# EAGLE design ATM9036_3P4W (EAGLE 9.6.2)
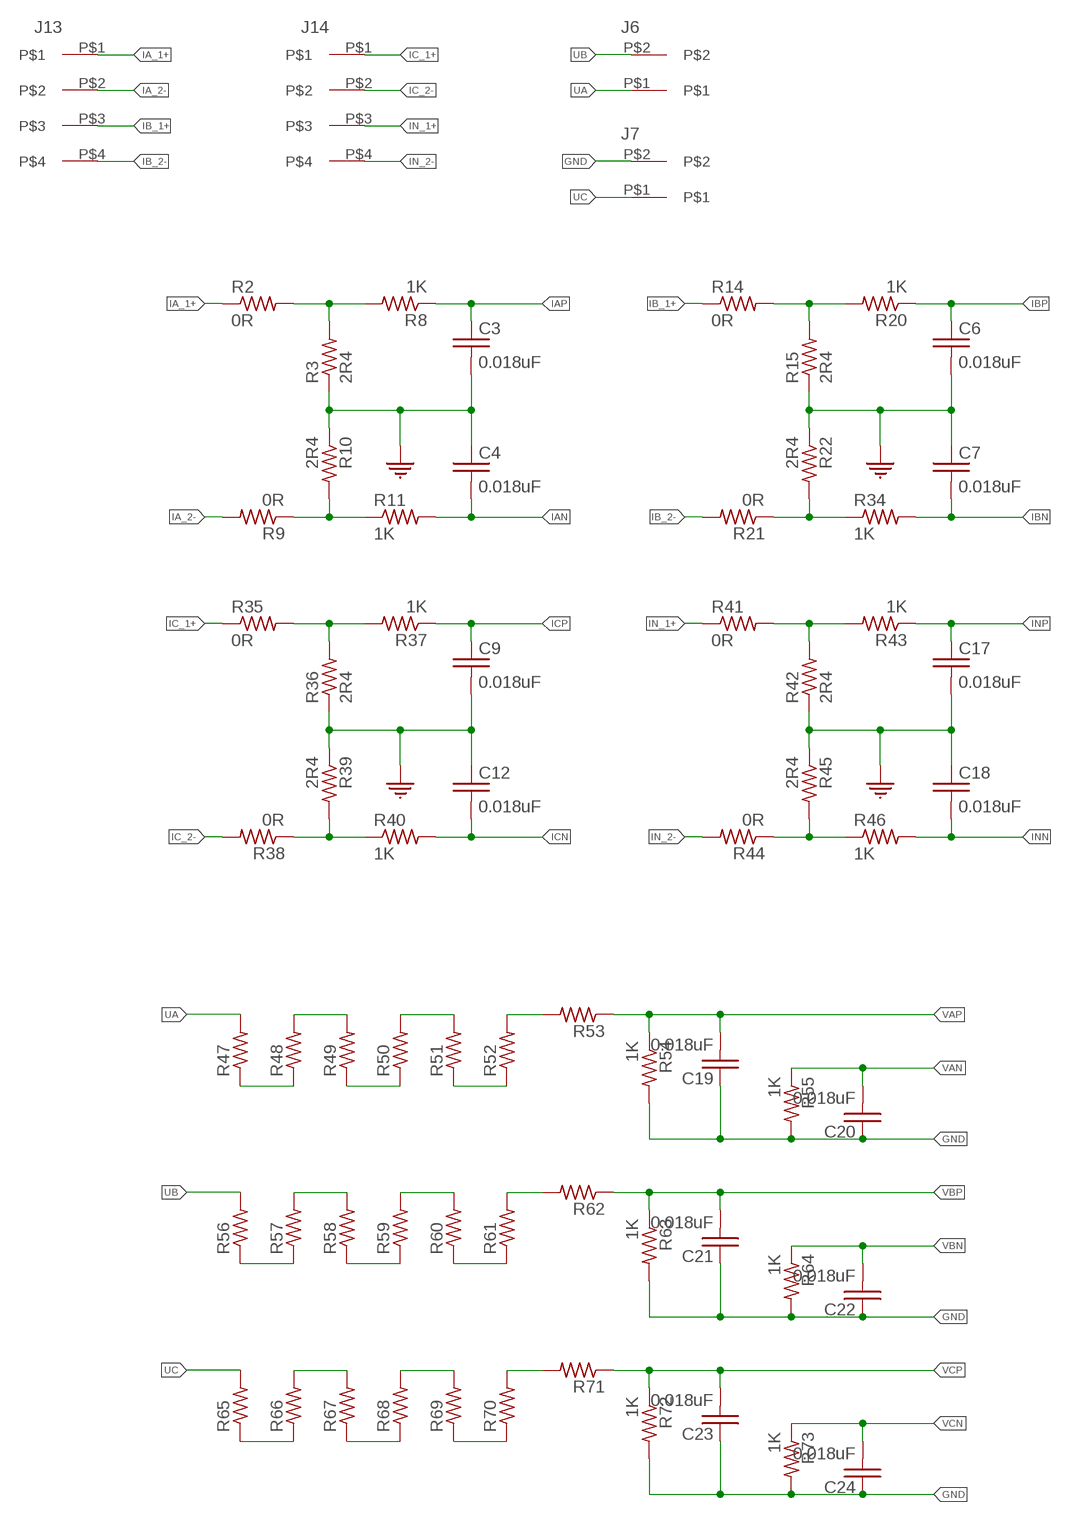
[diagram p0: schematic, sheet 1, part 1 of 2]
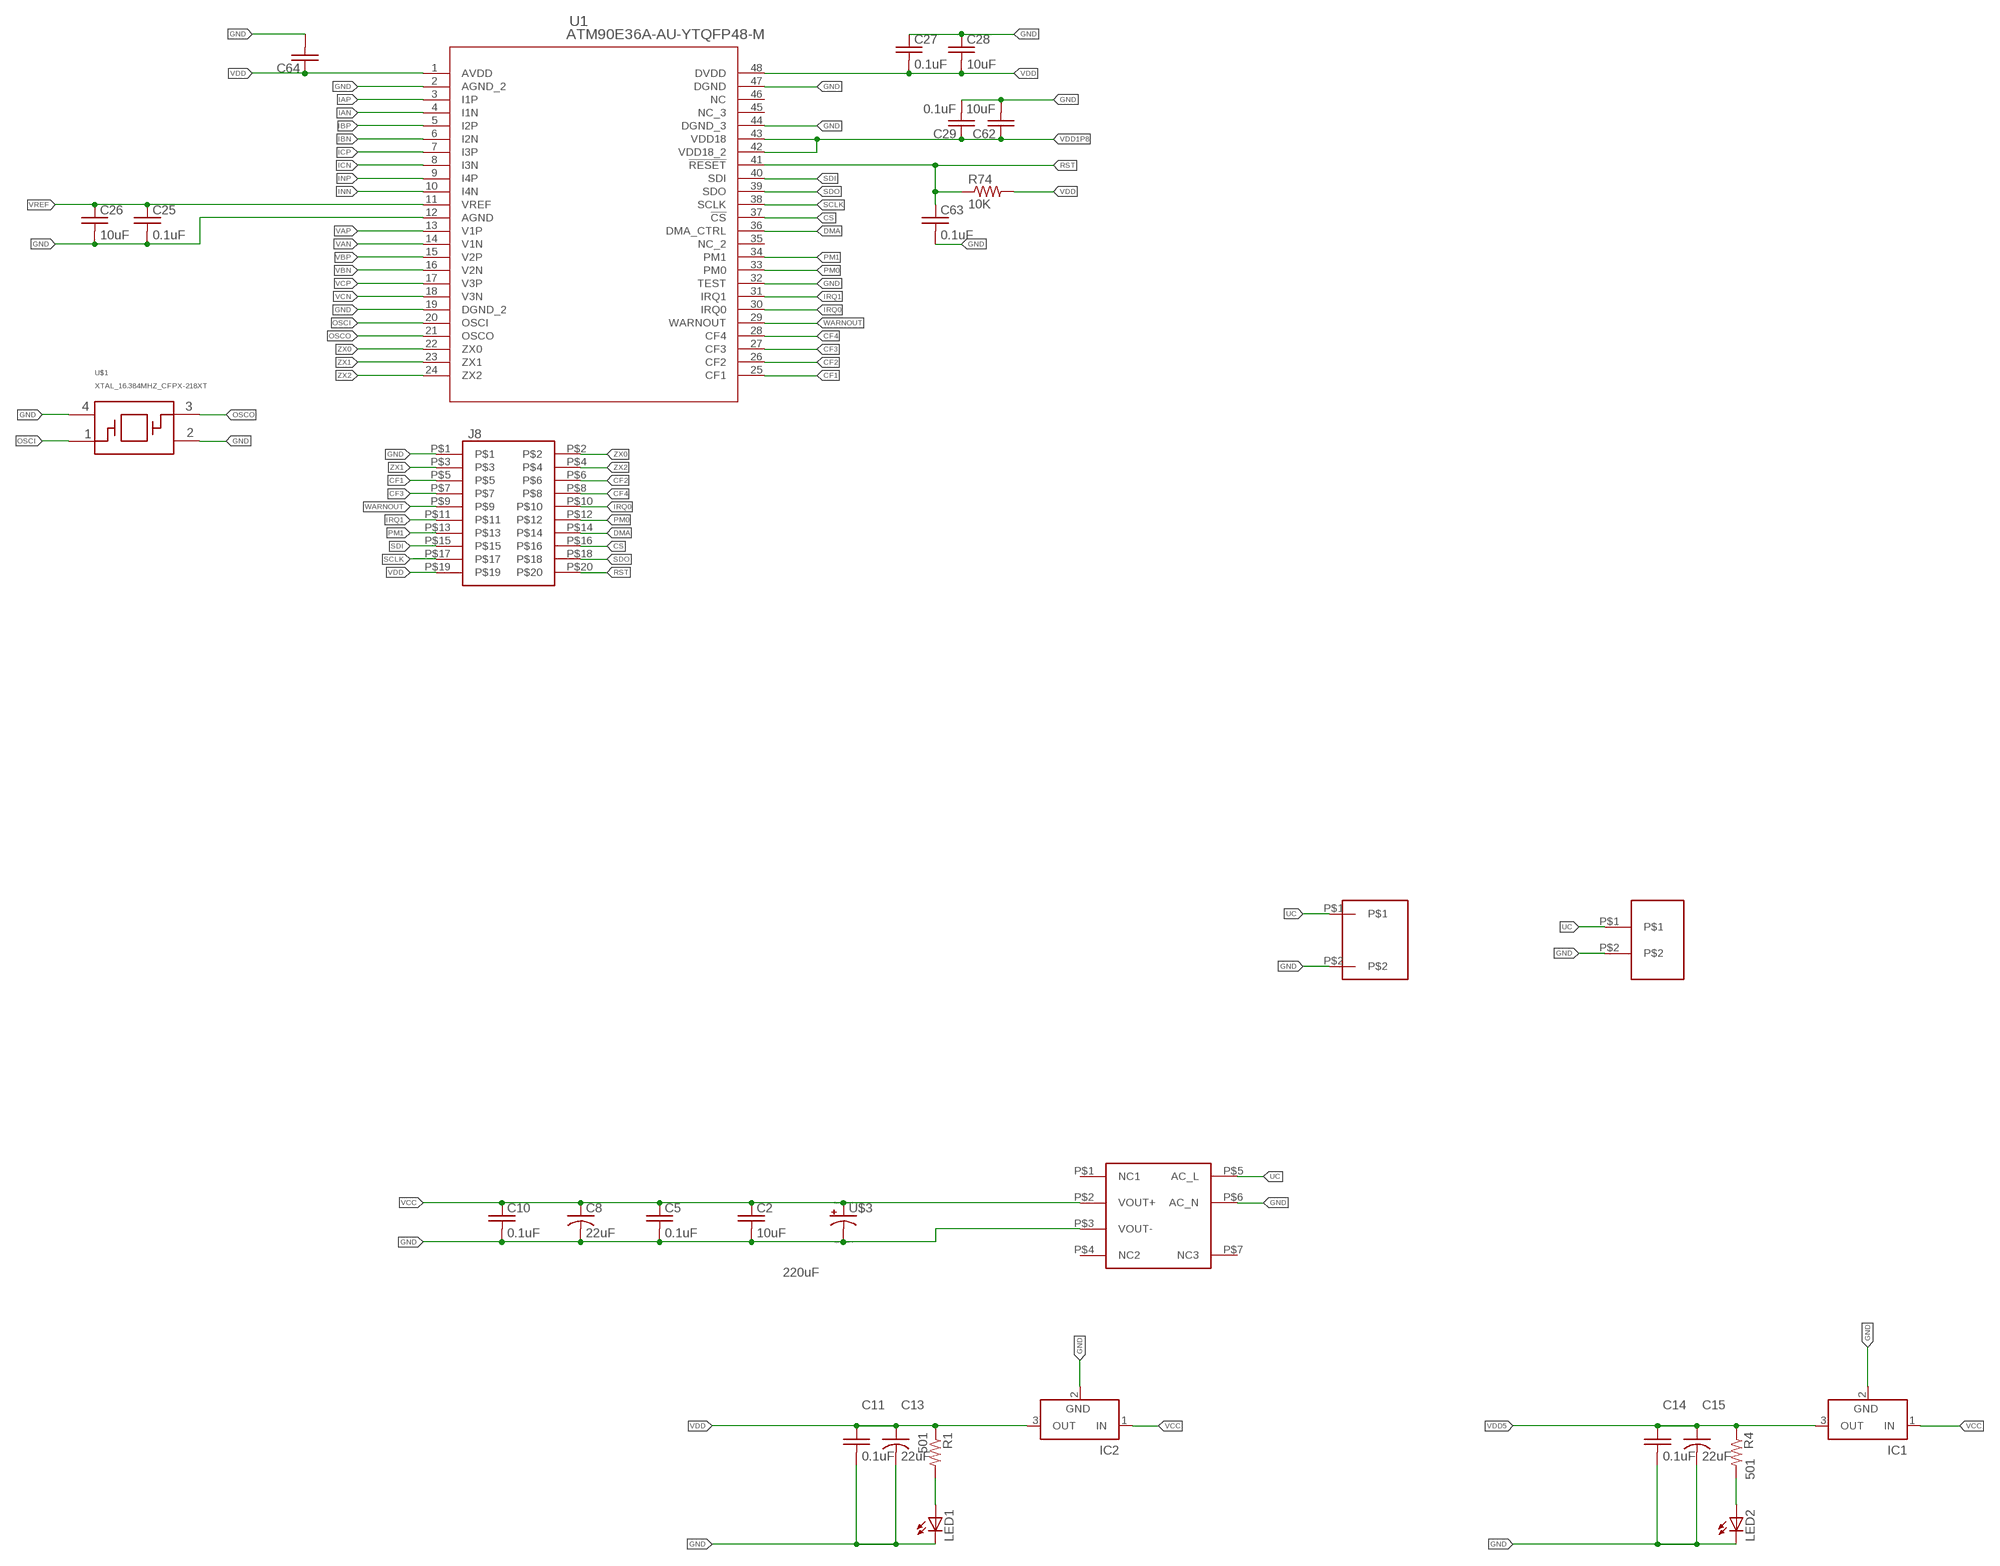
[diagram p1: schematic, sheet 1, part 2 of 2]

## Parts
C1  CAP_THIN_FILM_TDK_32922CAP  [CAP_THIN_FILM_32922]
C2  10uF  C_0402  [0402]
C3  0.018uF  C_0402  [0402]
C4  0.018uF  C_0402  [0402]
C5  0.1uF  C_0402  [0402]
C6  0.018uF  C_0402  [0402]
C7  0.018uF  C_0402  [0402]
C8  22uF  C-USC1206  [C1206]
C9  0.018uF  C_0402  [0402]
C10  0.1uF  C_0402  [0402]
C11  0.1uF  C_0402  [0402]
C12  0.018uF  C_0402  [0402]
C13  22uF  C-USC1206  [C1206]
C14  0.1uF  C_0402  [0402]
C15  22uF  C-USC1206  [C1206]
C17  0.018uF  C_0402  [0402]
C18  0.018uF  C_0402  [0402]
C19  0.018uF  C_0402  [0402]
C20  0.018uF  C_0402  [0402]
C21  0.018uF  C_0402  [0402]
C22  0.018uF  C_0402  [0402]
C23  0.018uF  C_0402  [0402]
C24  0.018uF  C_0402  [0402]
C25  0.1uF  C_0402  [0402]
C26  10uF  C_0402  [0402]
C27  0.1uF  C_0402  [0402]
C28  10uF  C_0402  [0402]
C29  0.1uF  C_0402  [0402]
C62  10uF  C_0402  [0402]
C63  0.1uF  C_0402  [0402]
C64  C_0402  [0402]
IC1  LT1129CST5  [SOT223]
IC2  LT1129CST3  [SOT223]
J6  3.81MM_1_X_2_RT_ANGLE_PLUG_HEADER  [2_3.81MM_PITCH]
J7  3.81MM_1_X_2_RT_ANGLE_PLUG_HEADER  [2_3.81MM_PITCH]
J8  2_X_10_HEADER_GENERIC  [2_X_10_.1_INCH]
J13  3.81MM_1_X_4_RT_ANGLE_PLUG_HEADER  [1X4_3.81MM_PITCH]
J14  3.81MM_1_X_4_RT_ANGLE_PLUG_HEADER  [1X4_3.81MM_PITCH]
LED1  LED_0805_GREEN  [LED_0805_GREEN]
LED2  LED_0805_GREEN  [LED_0805_GREEN]
R1  501  R_0402  [0402]
R2  0R  R_0402  [0402]
R3  2R4  R_0402  [0402]
R4  501  R_0402  [0402]
R8  1K  R_0402  [0402]
R9  0R  R_0402  [0402]
R10  2R4  R_0402  [0402]
R11  1K  R_0402  [0402]
R14  0R  R_0402  [0402]
R15  2R4  R_0402  [0402]
R20  1K  R_0402  [0402]
R21  0R  R_0402  [0402]
R22  2R4  R_0402  [0402]
R34  1K  R_0402  [0402]
R35  0R  R_0402  [0402]
R36  2R4  R_0402  [0402]
R37  1K  R_0402  [0402]
R38  0R  R_0402  [0402]
R39  2R4  R_0402  [0402]
R40  1K  R_0402  [0402]
R41  0R  R_0402  [0402]
R42  2R4  R_0402  [0402]
R43  1K  R_0402  [0402]
R44  0R  R_0402  [0402]
R45  2R4  R_0402  [0402]
R46  1K  R_0402  [0402]
R47  R_0402  [0402]
R48  R_0402  [0402]
R49  R_0402  [0402]
R50  R_0402  [0402]
R51  R_0402  [0402]
R52  R_0402  [0402]
R53  R_0402  [0402]
R54  1K  R_0402  [0402]
R55  1K  R_0402  [0402]
R56  R_0402  [0402]
R57  R_0402  [0402]
R58  R_0402  [0402]
R59  R_0402  [0402]
R60  R_0402  [0402]
R61  R_0402  [0402]
R62  R_0402  [0402]
R63  1K  R_0402  [0402]
R64  1K  R_0402  [0402]
R65  R_0402  [0402]
R66  R_0402  [0402]
R67  R_0402  [0402]
R68  R_0402  [0402]
R69  R_0402  [0402]
R70  R_0402  [0402]
R71  R_0402  [0402]
R72  1K  R_0402  [0402]
R73  1K  R_0402  [0402]
R74  10K  R_0402  [0402]
U1  ATM90E36A-AU-YTQFP48-M  [TQFP48-M]
U2  TMLM_04109  [TMLM04]
U$1  XTAL_16.384MHZ_CFPX-218XT  [XTAL_2.5X2.0]
U$2  VAR_10MM_VDRUS10  [VAR_10MM_VDRUS10]
U$3  220uF  C_AL_ELECTROLYTIC_SMD_220UF  [C_AL_ELECTROLYTIC_SMD_220UF]

## Nets
CF1: J8.P$5 U1.25(CF1)
CF2: J8.P$6 U1.26(CF2)
CF3: J8.P$7 U1.27(CF3)
CF4: J8.P$8 U1.28(CF4)
CS: J8.P$16 U1.37(!CS)
DMA: J8.P$14 U1.36(DMA_CTRL)
GND: C1.P$2 C2.P$2 C3.P$2 C4.P$1 C5.P$2 C6.P$2 C7.P$1 C8.2 C9.P$2 C10.P$2 C11.P$2 C12.P$1 C13.2 C14.P$2 C15.2 C17.P$2 C18.P$1 C19.P$1 C20.P$1 C21.P$1 C22.P$1 C23.P$1 C24.P$1 C25.P$2 C26.P$2 C27.P$1 C28.P$1 C29.P$2 C62.P$2 C63.P$2 C64.P$2 IC1.2(GND) IC2.2(GND) J7.P$2 J8.P$1 LED1.C LED2.C R3.P$1 R10.P$1 R15.P$1 R22.P$1 R36.P$1 R39.P$1 R42.P$1 R45.P$1 R54.P$2 R55.P$2 R63.P$2 R64.P$2 R72.P$2 R73.P$2 U1.2(AGND_2) U1.12(AGND) U1.19(DGND_2) U1.32(TEST) U1.44(DGND_3) U1.47(DGND) U2.P$3(VOUT-) U2.P$6(AC_N) U$1.2 U$1.4 U$2.P$2 U$3.N-(-)
IA_1+: J13.P$1 R2.P$1
IA_2-: J13.P$2 R9.P$2
IAN: C4.P$2 R11.P$2 U1.4(I1N)
IAP: C3.P$1 R8.P$1 U1.3(I1P)
IB_1+: J13.P$3 R14.P$1
IB_2-: J13.P$4 R21.P$2
IBN: C7.P$2 R34.P$2 U1.6(I2N)
IBP: C6.P$1 R20.P$1 U1.5(I2P)
IC_1+: J14.P$1 R35.P$1
IC_2-: J14.P$2 R38.P$2
ICN: C12.P$2 R40.P$2 U1.8(I3N)
ICP: C9.P$1 R37.P$1 U1.7(I3P)
IN_1+: J14.P$3 R41.P$1
IN_2-: J14.P$4 R44.P$2
INN: C18.P$2 R46.P$2 U1.10(I4N)
INP: C17.P$1 R43.P$1 U1.9(I4P)
IRQ0: J8.P$10 U1.30(IRQ0)
IRQ1: J8.P$11 U1.31(IRQ1)
N$1: LED1.A R1.P$2
N$2: R14.P$2 R15.P$2 R20.P$2
N$3: LED2.A R4.P$2
N$9: R21.P$1 R22.P$2 R34.P$1
N$10: R9.P$1 R10.P$2 R11.P$1
N$11: R35.P$2 R36.P$2 R37.P$2
N$12: R2.P$2 R3.P$2 R8.P$2
N$13: R38.P$1 R39.P$2 R40.P$1
N$14: R41.P$2 R42.P$2 R43.P$2
N$15: R44.P$1 R45.P$2 R46.P$1
N$16: R56.P$1 R57.P$1
N$17: R47.P$1 R48.P$1
N$18: R48.P$2 R49.P$2
N$19: R49.P$1 R50.P$1
N$20: R50.P$2 R51.P$2
N$21: R51.P$1 R52.P$1
N$22: R52.P$2 R53.P$2
N$23: R57.P$2 R58.P$2
N$24: R58.P$1 R59.P$1
N$25: R59.P$2 R60.P$2
N$26: R60.P$1 R61.P$1
N$27: R61.P$2 R62.P$2
N$28: R65.P$1 R66.P$1
N$29: R66.P$2 R67.P$2
N$30: R67.P$1 R68.P$1
N$31: R68.P$2 R69.P$2
N$32: R69.P$1 R70.P$1
N$33: R70.P$2 R71.P$2
OSCI: U1.20(OSCI) U$1.1
OSCO: U1.21(OSCO) U$1.3
PM0: J8.P$12 U1.33(PM0)
PM1: J8.P$13 U1.34(PM1)
RST: C63.P$1 J8.P$20 R74.P$1 U1.41(!RESET)
SCLK: J8.P$17 U1.38(SCLK)
SDI: J8.P$15 U1.40(SDI)
SDO: J8.P$18 U1.39(SDO)
UA: J6.P$1 R47.P$2
UB: J6.P$2 R56.P$2
UC: C1.P$1 J7.P$1 R65.P$2 U2.P$5(AC_L) U$2.P$1
VAN: C20.P$2 R55.P$1 U1.14(V1N)
VAP: C19.P$2 R53.P$1 R54.P$1 U1.13(V1P)
VBN: C22.P$2 R64.P$1 U1.16(V2N)
VBP: C21.P$2 R62.P$1 R63.P$1 U1.15(V2P)
VCC: C2.P$1 C5.P$1 C8.1 C10.P$1 IC1.1(IN) IC2.1(IN) U2.P$2(VOUT+) U$3.P+(+)
VCN: C24.P$2 R73.P$1 U1.18(V3N)
VCP: C23.P$2 R71.P$1 R72.P$1 U1.17(V3P)
VDD: C11.P$1 C13.1 C27.P$2 C28.P$2 C64.P$1 IC2.3(OUT) J8.P$19 R1.P$1 R74.P$2 U1.1(AVDD) U1.48(DVDD)
VDD1P8: C29.P$1 C62.P$1 U1.42(VDD18_2) U1.43(VDD18)
VDD5: C14.P$1 C15.1 IC1.3(OUT) R4.P$1
VREF: C25.P$1 C26.P$1 U1.11(VREF)
WARNOUT: J8.P$9 U1.29(WARNOUT)
ZX0: J8.P$2 U1.22(ZX0)
ZX1: J8.P$3 U1.23(ZX1)
ZX2: J8.P$4 U1.24(ZX2)
Unconnected: U1.35(NC_2) U1.45(NC_3) U1.46(NC) U2.P$1(NC1) U2.P$4(NC2) U2.P$7(NC3)

## Power pins joined to a net without a drawn wire
GND: IC1.4(GND) IC2.4(GND)

## Library data of the parts
C1 = 3D_MIG_Controller:CAP_THIN_FILM_TDK_32922
C2-C7 C9-C12 C14 C17-C29 C62-C64 = 3D_MIG_Controller:C_0402
C8 C13 C15 = 3D_MIG_Controller:C-US: CAPACITOR, American symbol
IC1 = 3D_MIG_Controller:LT1129CST5: VOLTAGE REGULATOR with shutdown; MPN: LT1129CST-5#PBF; OC_FARNELL: 1663375; OC_NEWARK: 57M2069
IC2 = 3D_MIG_Controller:LT1129CST3: VOLTAGE REGULATOR with shutdown; MPN: LT1129CST-5#PBF; OC_FARNELL: 1663375; OC_NEWARK: 57M2069
J6 J7 = 3D_MIG_Controller:3.81MM_1_X_2_RT_ANGLE_PLUG_HEADER
J8 = 3D_MIG_Controller:2_X_10_HEADER_GENERIC
J13 J14 = 3D_MIG_Controller:3.81MM_1_X_4_RT_ANGLE_PLUG_HEADER
LED1 LED2 = 3D_MIG_Controller:LED_0805_GREEN
R1-R4 R8-R11 R14 R15 R20-R22 R34-R74 = 3D_MIG_Controller:R_0402
U1 = 3D_MIG_Controller:ATM90E36A-AU-Y; MANUFACTURER_PART_NUMBER: ATM90E36AAUY; VENDOR: Atmel
U2 = 3D_MIG_Controller:TMLM_04109
U$1 = 3D_MIG_Controller:XTAL_16.384MHZ_CFPX-218
U$2 = 3D_MIG_Controller:VAR_10MM_VDRUS10
U$3 = 3D_MIG_Controller:C_AL_ELECTROLYTIC_SMD_220UF

## Board
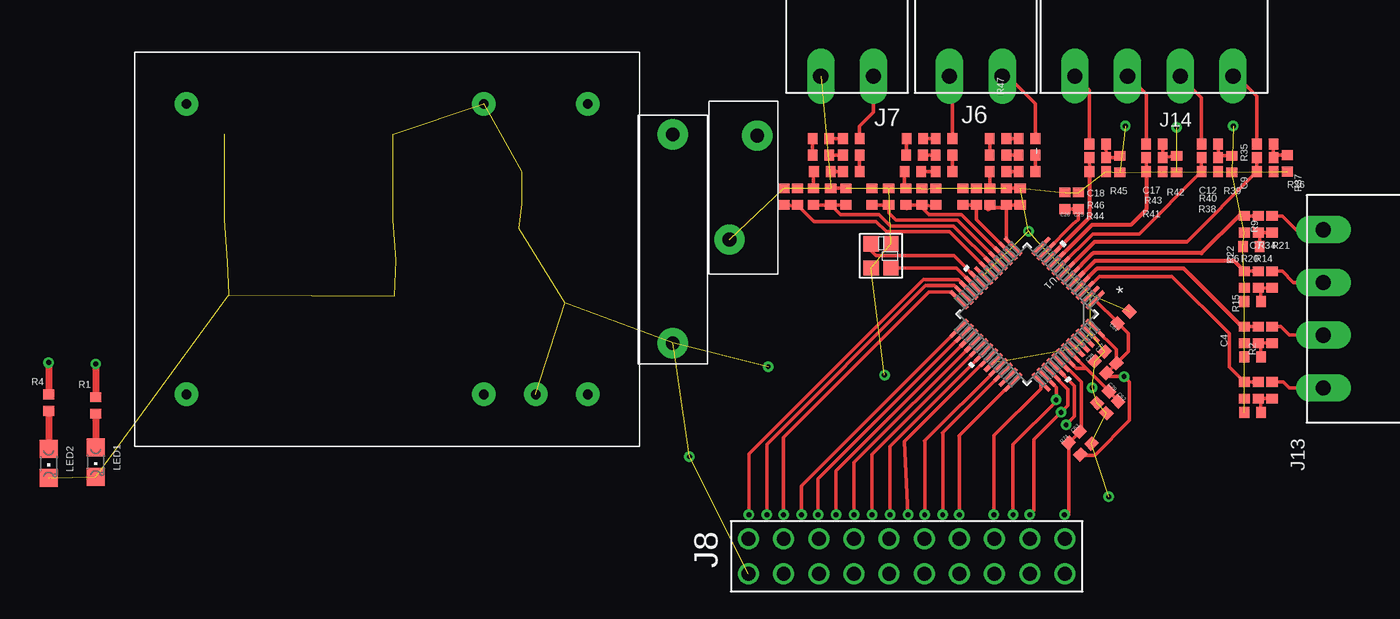
[diagram p2: board, top side]
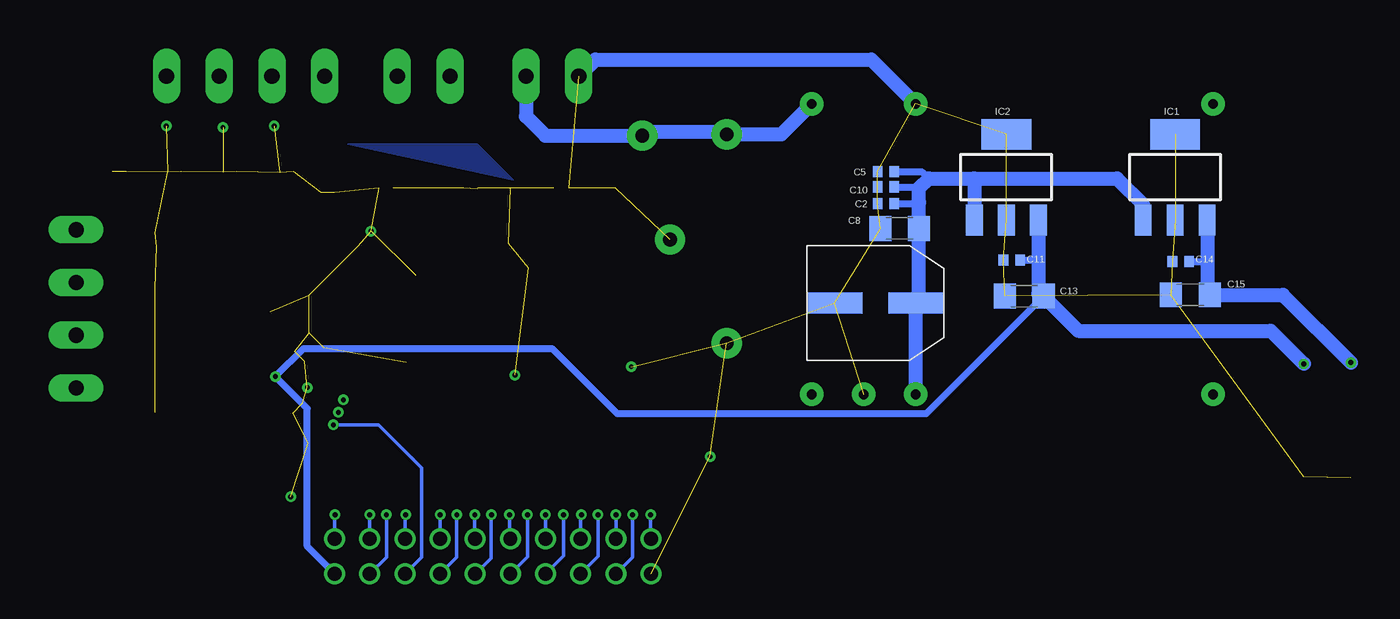
[diagram p3: board, bottom side, seen from below]

No outline drawn. Coordinates in mm, seen from the top.
Copper layers (1*16): Top 0.035mm / dielectric 1.5mm / Bottom 0.035mm
Design rules "default": minimum track width 6mil, minimum drill 0.35mm, track to track 6mil, track to pad 6mil, pad to pad 6mil, via to via 6mil, smd to smd 6mil, copper to edge 40mil, drill to drill 6mil, minimum pad ring 10mil, minimum via ring 8mil, stop-mask expansion 4mil, vias tented up to drill 0mil, thermal gap 10mil

### Footprints (pad centres in the part's own frame; a part is rotated, then mirrored left to right if it is on the bottom)
CAP_THIN_FILM_32922 = drill 1 pad 2.184: P$1 -0.1,0; P$2 15,0
0402 = smd 0.8 x 0.7: P$1 0,0.6; P$2 0,-0.6
C1206 = smd 1.6 x 1.8: 1 -1.4,0; 2 1.4,0
SOT223 = smd 1.219 x 2.235: 1 -2.311,-3.099; 2 0,-3.099; 3 2.311,-3.099 | smd 3.6 x 2.2: 4 0,3.099
2_3.81MM_PITCH = drill 1.1 pad 2 long: P$1 0,0; P$2 3.81,0
2_X_10_.1_INCH = drill 1: P$1 -11.43,-1.27; P$2 -11.43,1.27; P$3 -8.89,-1.27; P$4 -8.89,1.27; P$5 -6.35,-1.27; P$6 -6.35,1.27; P$7 -3.81,-1.27; P$8 -3.81,1.27; P$9 -1.27,-1.27; P$10 -1.27,1.27; P$11 1.27,-1.27; P$12 1.27,1.27; P$13 3.81,-1.27; P$14 3.81,1.27; P$15 6.35,-1.27; P$16 6.35,1.27; P$17 8.89,-1.27; P$18 8.89,1.27; P$19 11.43,-1.27; P$20 11.43,1.27
1X4_3.81MM_PITCH = drill 1.1 pad 2 long: P$1 0,0; P$2 3.81,0; P$3 7.62,0; P$4 11.43,0
LED_0805_GREEN = smd 1.3 x 1.3: A 0,-1.05; C 0,1.05
TQFP48-M = smd 1.716 x 0.27: 1 -4.201,2.75; 2 -4.201,2.25; 3 -4.201,1.75; 4 -4.201,1.25; 5 -4.201,0.75; 6 -4.201,0.25; 7 -4.201,-0.25; 8 -4.201,-0.75; 9 -4.201,-1.25; 10 -4.201,-1.75; 11 -4.201,-2.25; 12 -4.201,-2.75; 25 4.201,-2.75; 26 4.201,-2.25; 27 4.201,-1.75; 28 4.201,-1.25; 29 4.201,-0.75; 30 4.201,-0.25; 31 4.201,0.25; 32 4.201,0.75; 33 4.201,1.25; 34 4.201,1.75; 35 4.201,2.25; 36 4.201,2.75 | smd 0.27 x 1.716: 13 -2.75,-4.201; 14 -2.25,-4.201; 15 -1.75,-4.201; 16 -1.25,-4.201; 17 -0.75,-4.201; 18 -0.25,-4.201; 19 0.25,-4.201; 20 0.75,-4.201; 21 1.25,-4.201; 22 1.75,-4.201; 23 2.25,-4.201; 24 2.75,-4.201; 37 2.75,4.201; 38 2.25,4.201; 39 1.75,4.201; 40 1.25,4.201; 41 0.75,4.201; 42 0.25,4.201; 43 -0.25,4.201; 44 -0.75,4.201; 45 -1.25,4.201; 46 -1.75,4.201; 47 -2.25,4.201; 48 -2.75,4.201
TMLM04 = drill 0.7 pad 1.7: P$1 21,-25.25; P$2 21,-3.75; P$3 21,0; P$4 21,3.75; P$5 0,3.75; P$6 0,-3.75; P$7 0,-25.25
XTAL_2.5X2.0 = smd 1.1 x 1.1: 1 -0.875,-0.713; 2 0.875,-0.713; 3 0.875,0.713; 4 -0.875,0.713
VAR_10MM_VDRUS10 = drill 1 pad 2.184: P$1 0,1; P$2 7.5,-1
C_AL_ELECTROLYTIC_SMD_220UF = smd 1.5 x 4: N- 0,2; P+ 0,7.9

### Placement (x,y rotation side)
C1  48,92.5 270 top
C2  36.5,87.6 270 bottom
C3  89.3,74.1 0 top
C4  89.3,78.1 180 top
C5  36.5,89.9 270 bottom
C6  89.3,82.1 0 top
C7  89.3,86.1 180 top
C8  35.5,85.8 180 bottom
C9  90.8,89.9 90 top
C10  36.5,88.8 270 bottom
C11  27.4,83.5 270 bottom
C12  86.8,89.9 270 top
C13  26.5,80.9 180 bottom
C14  15.2,83.4 270 bottom
C15  14.5,81 180 bottom
C17  82.8,89.9 90 top
C18  78.7,89.9 270 top
C19  73.1,88.1 0 top
C20  68.97,88.1 0 top
C21  66,88.1 0 top
C22  63.6,88.1 0 top
C23  60.52,88.1 0 top
C24  56.03,88.1 0 top
C25  77.3,87.8 180 top
C26  76.32,87.8 180 top
C27  79.63,76.47 45 top
C28  78.91,75.77 45 top
C29  79.08,73.59 315 top
C62  79.75,72.87 315 top
C63  77.83,70.67 45 top
C64  80.57,79.37 135 top
IC1  15.6,89.5 0 bottom
IC2  27.8,89.5 0 bottom
J6  71.8,96.8 180 top
J7  62.5,96.8 180 top
J8  64.9,62.1 0 top
J13  95.01,74.27 90 top
J14  88.48,96.81 180 top
LED1  6.3,68.9 180 top
LED2  2.9,68.8 180 top
R1  6.3,73 0 top
R2  91.3,74.1 0 top
R3  89.9,72.5 90 top
R4  2.9,73.2 0 top
R8  90.3,74.1 0 top
R9  91.3,78.1 180 top
R10  89.9,76.5 90 top
R11  90.3,78.1 180 top
R14  91.3,82.1 0 top
R15  89.9,80.5 90 top
R20  90.3,82.1 0 top
R21  91.3,86.1 180 top
R22  89.8,84.5 90 top
R34  90.3,86.1 180 top
R35  90.8,91.9 90 top
R36  92.4,90.5 180 top
R37  90.8,90.9 90 top
R38  86.8,91.9 270 top
R39  88.4,90.45 180 top
R40  86.8,90.9 270 top
R41  82.8,91.9 90 top
R42  84.4,90.45 180 top
R43  82.8,90.9 90 top
R44  78.7,91.9 270 top
R45  80.3,90.44 180 top
R46  78.7,90.9 270 top
R47  73.6,92.3 90 top
R48  71.5,92.3 270 top
R49  71.5,91.1 270 top
R50  73.6,91.1 90 top
R51  73.6,89.9 90 top
R52  71.5,89.9 270 top
R53  70.9,88.1 180 top
R54  72.1,88.1 180 top
R55  69.93,88.1 180 top
R56  67.6,92.3 90 top
R57  65.5,92.3 270 top
R58  65.47,91.1 270 top
R59  67.6,91.1 90 top
R60  67.6,89.9 90 top
R61  65.35,89.9 270 top
R62  64.85,88.1 180 top
R63  67,88.1 180 top
R64  62.4,88.1 180 top
R65  60.9,92.3 90 top
R66  58.7,92.3 270 top
R67  58.7,91.1 270 top
R68  60.9,91.1 90 top
R69  60.9,89.9 90 top
R70  58.8,89.9 270 top
R71  58.17,88.1 180 top
R72  59.41,88.1 180 top
R73  57,88.1 180 top
R74  77.03,69.87 45 top
U1  73.6,79.6 225 top
U2  38.1,94.8 270 top
U$1  63.04,83.82 270 top
U$2  53.1,92.5 270 top
U$3  42.2,80.4 270 bottom

### Tracks (layer width: path | path; a pad name or v marks a point on that pad's centre or on a via)
CF1  (via drill 0.35)
  Top 0.254: U1.25 57.3,67.19 v57.3,65.1
  Bottom 0.254: v57.3,65.1 57.3,62.08 J8.P$5
CF2  (via drill 0.35)
  Top 0.254: U1.26 58.5,67.68 v58.5,65.1
  Bottom 0.254: v58.5,65.1 58.55,65.05 J8.P$6
CF3  (via drill 0.35)
  Top 0.254: U1.27 59.8,68.28 v59.8,65.1
  Bottom 0.254: v59.8,65.1 59.8,62.12 J8.P$7
CF4  (via drill 0.35)
  Top 0.254: U1.28 61.1,68.87 v61.1,65.1
  Bottom 0.254: v61.1,65.1 J8.P$8
CS  (via drill 0.35)
  Top 0.254: U1.37 74.61,74.67 74.61,74.2 71.25,70.85 71.2,70.84 v71.2,65.1
  Bottom 0.254: J8.P$16 71.25,65.1 v71.2,65.1
DMA  (via drill 0.35)
  Top 0.254: U1.36 68.69,70.8 68.7,70.79 v68.7,65.1
  Bottom 0.254: v68.7,65.1 J8.P$14
GND  (via drill 0.35)  (70 unrouted)
  Top 0.254: R72.P$2 C23.P$1 | R54.P$2 C19.P$1
  Top 0.508: C21.P$1 66.01,88.65
  Bottom 1.016: J7.P$2 57.49,98 37.55,98 U2.P$6
  other vias: 79.5,66.4 63.3,75.2 78.3,74.3 73.7,85.6 54.9,75.8 49.2,69.3 80.7,93.2 84.4,93.1 88.5,93.2
  pour Bottom (no thermals): 63.4,89.3 66,91.9 75.4,91.9
IA_1+
  Top 0.254: R2.P$1 92.13,74.7 92.56,74.27 J13.P$1
IA_2-
  Top 0.254: R9.P$2 91.93,78.7 92.55,78.08 J13.P$2
IAN
  Top 0.254: R11.P$2 C4.P$2
  Top 0.305: U1.4 78.65,82.89 84.91,82.89 89.1,78.7 C4.P$2
IAP
  Top 0.254: R8.P$1 C3.P$1 88.2,75.8 88.2,78.2 84.07,82.33 78.81,82.33 U1.3
IB_1+
  Top 0.254: R14.P$1 92.03,82.7 92.84,81.89 J13.P$3
IB_2-
  Top 0.254: R21.P$2 92.03,86.7 93.03,85.7 J13.P$4
IBN
  Top 0.254: R34.P$2 C7.P$2
  Top 0.305: U1.6 78.35,84 86.2,84 88.9,86.7 C7.P$2
IBP
  Top 0.254: R20.P$1 C6.P$1
  Top 0.305: U1.5 78.5,83.44 88.56,83.44 C6.P$1
IC_1+
  Top 0.254: R35.P$1 90.2,95.35 88.74,96.81 J14.P$1
IC_2-
  Top 0.254: R38.P$2 86.2,95.25 84.67,96.78 J14.P$2
ICN
  Top 0.254: R40.P$2 C12.P$2 81.7,85.4 78.34,85.4 U1.8
ICP
  Top 0.254: R37.P$1 C9.P$1 85.13,84.83
  Top 0.305: 85.13,84.83 78.47,84.83 U1.7
IN_1+
  Top 0.254: R41.P$1 82.2,95.5 80.89,96.81 J14.P$3
IN_2-
  Top 0.254: R44.P$2 78.1,95.8 77.09,96.81 J14.P$4
INN
  Top 0.254: R46.P$2 78.13,89.87 C18.P$2
  Top 0.305: C18.P$2 78.1,86.58 U1.10
INP
  Top 0.254: R43.P$1 82.23,89.74 C17.P$1
  Top 0.305: C17.P$1 82.2,87.17 81.09,86.05 78.29,86.05 U1.9
IRQ0  (via drill 0.35)
  Top 0.254: U1.30 63.7,70.05 v63.7,65.1
  Bottom 0.254: v63.7,65.1 63.7,63.44 J8.P$10
IRQ1  (via drill 0.35)
  Top 0.254: U1.31 64.75,70.4 v65,65.1
  Bottom 0.254: v65,65.1 65.04,65.06 65.04,61.96 J8.P$11
N$1
  Top 0.508: R1.P$2 LED1.A
N$2
  Top 0.254: R15.P$2 90.5,81.3 R20.P$2 R14.P$2
N$3
  Top 0.508: R4.P$2 LED2.A
N$9
  Top 0.254: R22.P$2 90.4,85.4 R34.P$1 R21.P$1
N$10
  Top 0.254: R10.P$2 90.5,77.3 R11.P$1 R9.P$1
N$11
  Top 0.254: R36.P$2 91.6,91.1 R37.P$2 R35.P$2
N$12
  Top 0.254: R2.P$2 R8.P$2 90.5,73.3 R3.P$2
N$13
  Top 0.254: R38.P$1 R40.P$1 87.55,91.05 R39.P$2
N$14
  Top 0.254: R41.P$2 83.44,90.77 R43.P$2 83.43,90.93 R42.P$2
N$15
  Top 0.254: R45.P$2 80.3,90.9 R46.P$1 79.34,90.87 R44.P$1
N$16
  Top 0.254: R57.P$1 R56.P$1
N$17
  Top 0.254: R48.P$1 R47.P$1
N$18
  Top 0.254: R49.P$2 R48.P$2
N$19
  Top 0.254: R50.P$1 R49.P$1
N$20
  Top 0.254: R51.P$2 R50.P$2
N$21
  Top 0.254: R52.P$1 R51.P$1
N$22
  Top 0.254: R53.P$2 R52.P$2
N$23
  Top 0.254: R58.P$2 64.87,91.97 R57.P$2
N$24
  Top 0.254: R59.P$1 R58.P$1
N$25
  Top 0.254: R60.P$2 R59.P$2
N$26
  Top 0.254: R61.P$1 R60.P$1
N$27
  Top 0.254: R62.P$2 64.75,88.7 R61.P$2
N$28
  Top 0.254: R66.P$1 R65.P$1
N$29
  Top 0.254: R67.P$2 R66.P$2
N$30
  Top 0.254: R68.P$1 R67.P$1
N$31
  Top 0.254: R69.P$2 R68.P$2
N$32
  Top 0.254: R70.P$1 R69.P$1
N$33
  Top 0.254: R71.P$2 58.17,89.57 R70.P$2
OSCI
  Top 0.254: U1.20 68.32,83.82 62.69,83.82 62.33,84.18 U$1.1
OSCO
  Top 0.254: U$1.3 68.49,82.94 U1.21
PM0  (via drill 0.35)
  Top 0.254: U1.33 66.2,70.43 v66.2,65.1
  Bottom 0.254: v66.2,65.1 66.2,63.4 J8.P$12
PM1  (via drill 0.35)
  Top 0.254: U1.34 67.49,71.02 67.5,71.01 v67.5,65.1
  Bottom 0.254: v67.5,65.1 67.5,62.04 J8.P$13
RST  (via drill 0.35)
  Top 0.254: v76.3,65.1 76.61,65.1 R74.P$1 C63.P$1 77.5,71.19 77.5,74.69 76.1,76.1 U1.41
  Bottom 0.254: J8.P$20 76.33,65.07 v76.3,65.1
SCLK  (via drill 0.35)
  Top 0.254: U1.38 75.7,74.32 v75.7,73.4 75.7,73.3 72.59,70.19 v72.59,65.1
  Bottom 0.254: v72.59,65.1 72.59,62.03 J8.P$17
SDI  (via drill 0.35)
  Top 0.254: U1.40 77.02,74.42 77.02,72.2 v76.42,71.6
  Bottom 0.254: v76.42,71.6 73.15,71.6 70.05,68.5 70.05,62.03 J8.P$15
SDO  (via drill 0.35)
  Top 0.254: U1.39 76.56,74.17 76.56,73 v76.06,72.5 74.09,70.53 74.09,65.4 v73.79,65.1
  Bottom 0.254: J8.P$18 v73.79,65.1
UA
  Top 0.254: R47.P$2 74.2,94.8 72.2,96.8 J6.P$1
UB
  Top 0.254: R56.P$2 68.2,94.98 67.99,95.19 J6.P$2
UC
  Top 0.254: J7.P$1 62.5,94.2 61.5,93.2 R65.P$2
  Bottom 1.016: J7.P$1 62.5,93.9 61.1,92.5 U$2.P$1 53.8,92.8 48,92.8 C1.P$1 44.05,92.6 U2.P$5
VAN
  Top 0.254: U1.14 69.93,86.45 R55.P$1 C20.P$2
VAP
  Top 0.254: R54.P$1 72.1,84.99 U1.13 | C19.P$2 R54.P$1 | R54.P$1 72,87.3 70.8,87.3
  Top 0.508: 70.8,87.3 R53.P$1
VBN
  Top 0.254: U1.16 68.58,86.39 64.11,86.39 63.6,86.9 C22.P$2 R64.P$1
VBP
  Top 0.254: U1.15 68.87,86.81 66.49,86.81 66,87.3 C21.P$2 | C21.P$2 R62.P$1 | C21.P$2 66.95,87.4 66.99,87.44
  Top 0.508: R62.P$1 64.9,87.35 | 65.97,87.47 C21.P$2 | 66.99,87.44 R63.P$1
VCC
  Bottom 0.508: C5.P$1 33.9,89.9 33.4,89.4 | C10.P$1 34.2,88.8 34.1,88.7 | C2.P$1 34.2,87.6 34.1,87.7
  Bottom 1.016: U2.P$2 34.35,80.35 U$3.P+ 34.1,80.6 C8.1 34.1,87.7 34.1,88.7 33.4,89.4 30.11,89.4 | 30.11,89.4 IC2.1 | 30.11,89.4 19.8,89.4 17.91,87.51 IC1.1
VCN
  Top 0.254: U1.18 67.99,85.56 63.43,85.56 62.69,86.3 58.2,86.3 R73.P$1 56.97,87.43 C24.P$2
VCP
  Top 0.254: U1.17 68.29,85.97 63.74,85.97 62.91,86.8 60.11,86.8 R72.P$1 | C23.P$2 R72.P$1 | R72.P$1 R71.P$1
VDD  (via drill 0.35)
  Top 0.254: U1.1 80.15,78.99 C64.P$1 80.9,78.19 80.9,76.89 C27.P$2 | C27.P$2 79.36,75.35 C28.P$2 79.59,75.08 v80.61,75.08 81,74.7 81,71.9 78.5,69.4 77.5,69.4 R74.P$2 | C27.P$2 80.06,77.03 U1.48
  Top 0.508: v6.3,76 R1.P$1
  Bottom 0.508: J8.P$19 78.3,62.8 78.3,72.77 v80.61,75.08 78.6,77.1 60.6,77.1 55.9,72.4 33.6,72.4 25.2,80.8 | C13.1 25.2,80.8 | IC2.3 | 25.5,81.1 25.2,80.8 | C11.P$1 25.59,83.5 25.49,83.6
  Bottom 1.016: C13.1 22.6,78.4 8.7,78.4 v6.3,76 | IC2.3 25.49,83.6 25.49,81.09 25.2,80.8
VDD1P8
  Top 0.254: 76.39,76.43 U1.42 77.17,75.67 77.87,75.67 | 77.87,75.67 79.5,74.04 C29.P$1 80.17,73.35 C62.P$1 | 77.87,75.67 U1.43
VDD5  (via drill 0.35)
  Top 0.508: v2.9,76.1 R4.P$1
  Bottom 0.508: 14.69,83.49 C14.P$1 13.39,83.4 13.29,83.5 | 13.2,81.1 C15.1
  Bottom 1.016: 13.05,81.05 C15.1 7.8,81 v2.9,76.1 | IC1.3 13.29,83.5 13.29,81.19 13.2,81.1
VREF
  Top 0.254: U1.11 76.92,86.1 77.3,86.43 C25.P$1 C26.P$1
WARNOUT  (via drill 0.35)
  Top 0.254: U1.29 62.4,69.46 v62.4,65.1
  Bottom 0.254: v62.4,65.1 62.4,62.06 J8.P$9
ZX0  (via drill 0.35)
  Top 0.254: U1.22 68.62,82.1 66.1,82.1 53.5,69.5 v53.5,65.1
  Bottom 0.254: v53.5,65.1 53.5,63.4 J8.P$2
ZX1  (via drill 0.35)
  Top 0.254: U1.23 68.36,81.66 66.26,81.66 54.8,70.2 v54.8,65.1
  Bottom 0.254: v54.8,65.1 54.8,62.04 J8.P$3
ZX2  (via drill 0.35)
  Top 0.254: U1.24 68.11,81.2 66.5,81.2 56,70.7 v56,65.1
  Bottom 0.254: v56,65.1 J8.P$4